# Altium project SAMC21N_Xplained_Pro.PrjPCB (part 3 of 3)

## Sheet SAMC21N_Xplained_Pro_Peripherals.SchDoc: Peripherals
size A3; Organization: Microchip India; DocumentNumber: A09-2682; Revision: 4; SheetNumber: 8; SheetTotal: 9; CheckedBy: M.S.K; DrawnBy: Microchip India; PageSetup: Record=PageOptions|CenterHorizontal=True|CenterVertical=True|PrintScale=1.01|XCorrection=1.00|YCorrection=1.00|PrintKind=1|BorderSize=5000000|LeftOffset=0|BottomOffset=0|Orientation=2|PaperLength=1000|PaperWidth=1000|Scale=100|PaperSource=7|PrintQuality=-4|MediaType=1|DitherType=10|PaperKind=A3 (297 x 420 mm)|PrintScaleMode=1; ProjectTitle: ATSAMC21N-XPRO; PCBNumber: A08-2581; PCBRevision: 2
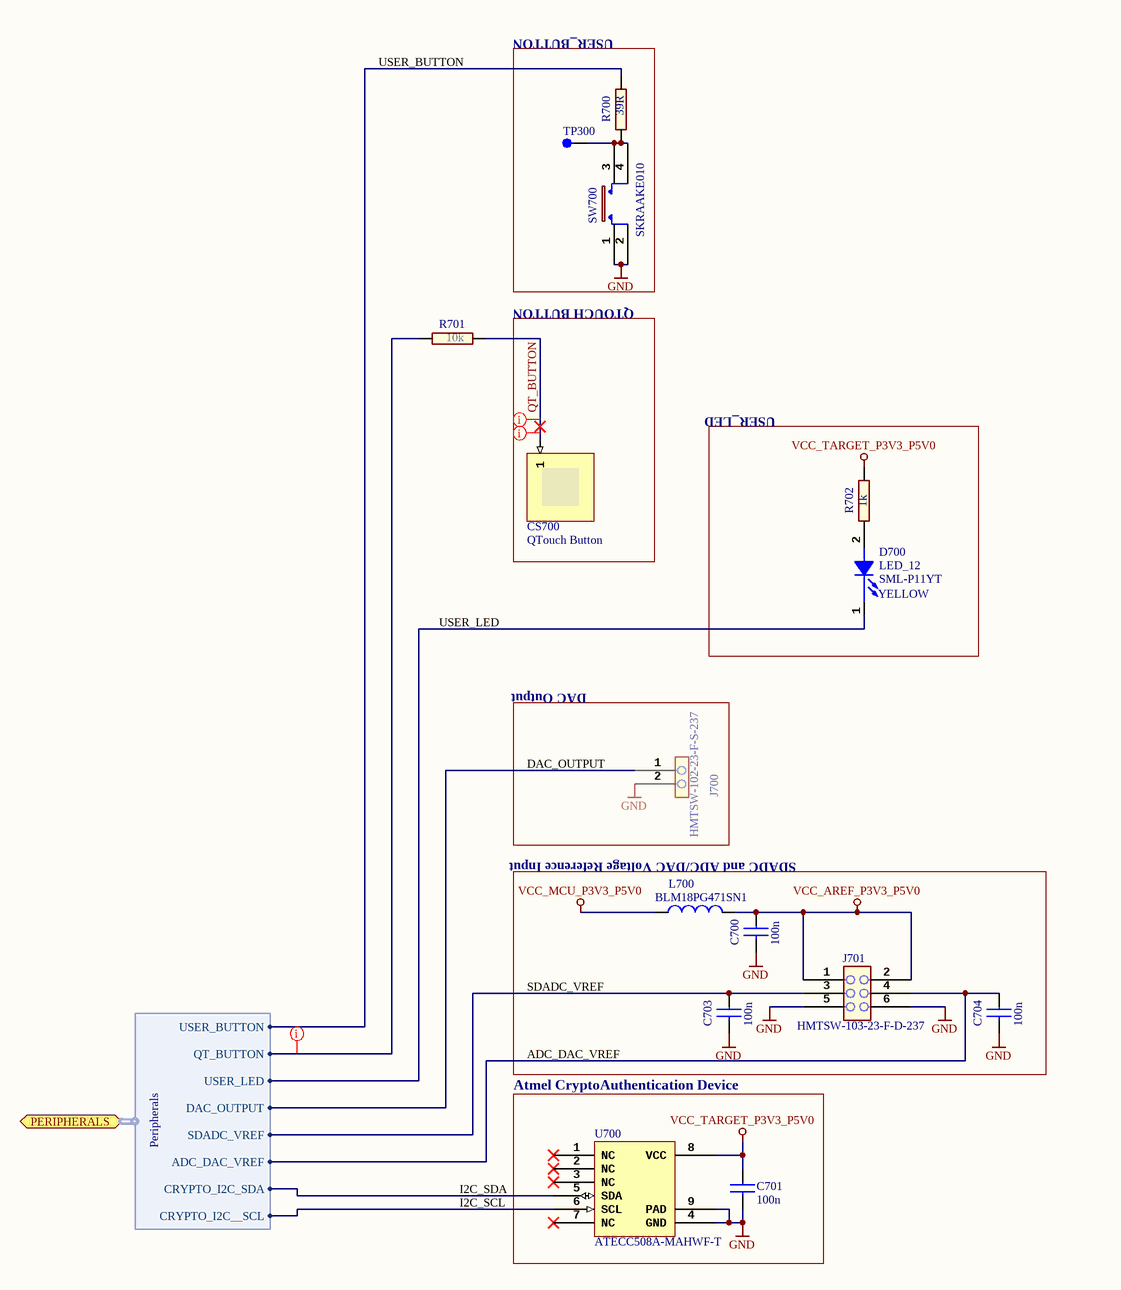
[diagram p8: SAMC21N_Xplained_Pro_Peripherals.SchDoc]

### Parts
C700  value 100n  [AP1-00001]  (hidden comment: CAP-NONPOL)
C701  value 100n  [AP1-00001]  (hidden comment: CAP-NONPOL)
C703  value 100n  [AP1-00001]  (hidden comment: CAP-NONPOL)
C704  value 100n  [AP1-00001]  (hidden comment: CAP-NONPOL)
CS700  QTouch Button  (graphical)
D700  LED_12  value SML-P11YT  [AP4-00160]
J700  value HMTSW-102-23-F-S-237  [AP8-00733]  (hidden comment: HEADER 1x2)
J701  value HMTSW-103-23-F-D-237  [AP8-00182]  (hidden comment: HEADER 2x3)
L700  BLM18PG471SN1  [AP3-00005]
R700  value 39R  [AP2-00000]  (hidden comment: R2)
R701  value 10k  [AP2-00000]  (hidden comment: R2)
R702  value 1k  [AP2-00000]  (hidden comment: R2)
SW700  value SKRAAKE010  [AP8-00137]  (hidden comment: Can be ordered in low volumes from Mouser)
TP300  TESTPOINT  [AP8-00010]  (value not drawn)  (no BOM)
U700  value ATECC508A-MAHWF-T  [AP6-00409]  (hidden comment: ATECC108_UDFN)

### Blocks framed on the sheet
USER_BUTTON: R700 SW700 TP300
QTOUCH BUTTON: CS700
USER_LED: D700 R702
DAC Output: J700
SDADC and ADC/DAC Voltage Reference Input: C700 C703 C704 J701 L700
Atmel CryptoAuthentication Device: C701 U700

### Ports
PERIPHERALS (harness Peripherals)

### Harnesses
Peripherals: DAC_OUTPUT, ADC_DAC_VREF, SDADC_VREF, QT_BUTTON, USER_LED, USER_BUTTON, CRYPTO_I2C__SCL, CRYPTO_I2C_SDA

### Nets
GND: C700.2 C701.2 C703.2 C704.2 J700.2 J701.5 J701.6 SW700.1 SW700.2 U700.4(GND) U700.9(PAD)
VCC_AREF_P3V3_P5V0: C700.1 J701.1 J701.2 L700.2
VCC_MCU_P3V3_P5V0: L700.1
VCC_TARGET_P3V3_P5V0: C701.1 R702.2 U700.8(VCC)
PA02_DAC_VOUT: J700.1 ; port PERIPHERALS.DAC_OUTPUT
PA03_ADC_DAC_VREF: C704.1 J701.4 ; port PERIPHERALS.ADC_DAC_VREF
PA04_SDADC_VREF: C703.1 J701.3 ; port PERIPHERALS.SDADC_VREF
PA05_QTB_Y3: R701.1 ; port PERIPHERALS.QT_BUTTON
PA16_S1_I2C_SDA: U700.5(SDA) ; port PERIPHERALS.CRYPTO_I2C_SDA
PA17_S1_I2C_SCL: U700.6(SCL) ; port PERIPHERALS.CRYPTO_I2C__SCL
PB19_GPIO_IRQ3: R700.2 ; port PERIPHERALS.USER_BUTTON
PC05_TCC2_WO1: D700.1(CATHODE) ; port PERIPHERALS.USER_LED
QT_BUTTON: CS700.1 R701.2
NetD700_2: D700.2(ANODE) R702.1
NetR700_1: R700.1 SW700.3 SW700.4 TP300.1

Not connected (* = marked no-connect by the designer): U700 1(NC)* 2(NC)* 3(NC)* 7(NC)*

### Layout directives
rule Assembly Testpoint Usage [Testpoint - Not Allowed    Multiple - Not Allowed]: PA05_QTB_Y3, QT_BUTTON
net class TOUCH; rule Clearance Constraint [Clearance = 0.6mm]: QT_BUTTON

### Notes on the sheet
- USER_BUTTON
- USER_LED
- (near D700) YELLOW
- DAC_OUTPUT
- SDADC_VREF
- ADC_DAC_VREF
- I2C_SDA
- I2C_SCL
- Drawn By:
- Project Title
- Engineer:
- Designed with
- Sheet Title
- Size
- A3
- PCB Number:
- PCB Assembly Number:
- PCBA Revision:
- PCB    Revision:
- Date:
- Altium.com <http://go.altium.com/MicrochipLandingPage_Evaluation.html>
- File:
- Page:

### Library data of the parts
C700 C701 C703 C704 = A01-0246: Ceramic capacitor, SMD 0402, X7R, 16V, +/-10%; PartGroup: Capacitors,Ceramic,SMD 0402; Manufacturer: Kemet; MPN: C0402C104K4RACTU; TemperatureRange: -55 - +125 deg C; ComponentStatus: 'Active (verified)'; Status: Active; Verified by: Lars Helge Mo; Verified date: 2005-12-15; AN: A01-0246; Tolerance: 16V, +/-10%; FootprintStatus: 'Active (Verified)'
  C700 C703 C704: Height: 0,5
  C701: Height: 0.5
CS700 = QTouchButton: ConfiguratorName: ATMEL_TOUCH; ConfigurationParameters: {}__sensorid[1]{}width[8]{}height[8]{}
D700 = A10-0182: LED, SMD 0402, Yellow, Wave length=586nm, 7.6mcd @ (1mA, 1.9Vf); PartGroup: Opto,LEDs,SMD; Manufacturer: ROHM; MPN: SML-P11YT-T86; TemperatureRange: -40 to +85; ComponentStatus: 'Active (verified)'; Verified date: 2006-02-17; Verified by: Sveinung Helgeland; Status: Active; AN: A10-0182; Height: 0.200000002980232; FootprintStatus: 'Active (Verified)'
J700 = A08-1754: 1x2 pin header, 2.54mm pitch, Pin-in-Paste THM; PartGroup: Mechanical devices,Connectors,Pin headers; Manufacturer: SAMTEC; TemperatureRange: - 55 deg C to + 125 deg C; ComponentStatus: 'Active (verified)'; Verified date: 2006-01-30; Verified by: Lars Helge; Status: Active; AN: A08-1754; Height: 6,09999990463257; MPN: HMTSW-102-23-F-S-237; FootprintStatus: 'Active (Verified)'
J701 = A08-1654: 2x3 pin header, 2.54mm pitch, Pin-in-Paste THM; PartGroup: Mechanical devices,Connectors,Pin headers; Manufacturer: SAMTEC; TemperatureRange: - 55 ï¿½C to + 125 ï¿½C; ComponentStatus: 'Active (verified)'; Status: Active; Verified by: Lars Helge Mo; Verified date: 2005-12-15; AN: A08-1654; Height: 6,09999990463257; MPN: HMTSW-103-23-F-D-237; FootprintStatus: 'Active (Verified)'
L700 = A03-0035: SMD RF inductor 0603. Z=470Ohm (@100MHz), Max R(dc)=0.65Ohm, Max current=1A; PartGroup: Inductors,EMI; Manufacturer: Murata; Tolerance: ±25%; TemperatureRange: -55°C to +125°C; ComponentStatus: 'Active (verified)'; Verified date: 2006-01-30; Verified by: Lars Helge Mo; Status: Active; AN: A03-0035; Value: BLM18PG471SN1; Height: 0,800000011920929; MPN: BLM18PG471SN1; FootprintStatus: 'Active (Verified)'
R700 = A02-0178: Thick film resistor, SMD 0402, 1/16W, 1%; PartGroup: Resistors,SMD,0402 1%; TemperatureRange: -55 - +125 deg C; ComponentStatus: 'Active (verified)'; Status: Active; Verified by: Lars Helge Mo; Verified date: 2005-12-19; AN: A02-0178; Tolerance: 1 %; Height: 0,349999994039536; FootprintStatus: 'Active (Verified)'
R701 = A02-0236: Thick film resistor, SMD 0402, 1/16W, 1%; PartGroup: Resistors,SMD,0402 1%; Manufacturer: vishay; MPN: CRCW040210K0FKED; TemperatureRange: -55 - +125 deg C; ComponentStatus: 'Active (verified)'; Status: Active; Verified by: Lars Helge Mo; Verified date: 2005-12-19; AN: A02-0236; Tolerance: 1 %; Height: 0,349999994039536; FootprintStatus: 'Active (Verified)'
R702 = A02-0212: Thick film resistor, SMD 0402, 1/16W, 1%; PartGroup: Resistors,SMD,0402 1%; Manufacturer: ASJ; MPN: CR10-1001-FK; TemperatureRange: -55 - +125 deg C; ComponentStatus: 'Active (verified)'; Status: Active; Verified by: Lars Helge Mo; Verified date: 2005-12-19; AN: A02-0212; Tolerance: 1 %; Height: 0.349999994039536; FootprintStatus: 'Active (Verified)'
SW700 = A08-0790: 6.2x6.2 mm SMD tact switch, same as A08-0091 but less force is needed; PartGroup: Mechanical devices,Switches,SMD; Manufacturer: ALPS; TemperatureRange: -30 - +90 deg C; ComponentStatus: 'Active (verified)'; Status: Active; Verified by: Ketil Skjerve; Verified date: 2006-03-15; AN: A08-0790; Height: 5,09999990463257; MPN: SKRAAKE010; FootprintStatus: 'Active (Verified)'
TP300 = A08-0004: Single SMD testpad; PartGroup: Mechanical devices,Connectors,Test points; ComponentStatus: 'Active (verified)'; Status: Active; Verified by: Sveinung Helgeland; Verified date: 2006-02-17; AN: A08-0004; Value: TESTPAD; Height: 0; FootprintStatus: 'Active (Verified)'
U700 = A06-1294: Secure authentication and product validation device, EEPROM, I2C, 2.0 - 5.5V, UDFN8; PartGroup: Integrated Circuits,Special function,Encryption; Manufacturer: ATMEL; ComponentStatus: 'Active (verified)'; Status: New; AN: A06-1294; Height: 0.600000023841858; MPN: ATECC508A-MAHWF-T; FootprintStatus: 'Active (Verified)'

## Nets that join several sheets
GND: SAMC21N_Xplained_Pro_Target_MCU (26 pins), SAMC21N_Xplained_Pro_EDBG (36 pins), SAMC21N_Xplained_Pro_Connectors (9 pins), SAMC21N_Xplained_Pro_dual_input_power_supply (22 pins), SAMC21N_Xplained_Pro_CAN_LIN (23 pins), SAMC21N_Xplained_Pro_Arduino_Connectors (J800.6 J801.7 J802.6 J802.7), SAMC21N_Xplained_Pro_Level_Converters (56 pins), SAMC21N_Xplained_Pro_Peripherals (11 pins)
VCC_EDBG_P3V3: SAMC21N_Xplained_Pro_EDBG (23 pins), SAMC21N_Xplained_Pro_dual_input_power_supply (J105.1), SAMC21N_Xplained_Pro_Level_Converters (31 pins)
VCC_EDBG_USB_P5V0: SAMC21N_Xplained_Pro_EDBG (C408.1 L401.2 U400.A10), SAMC21N_Xplained_Pro_dual_input_power_supply (Q100.1 R103.2)
VCC_EXT_P5V0: SAMC21N_Xplained_Pro_dual_input_power_supply (5 pins), SAMC21N_Xplained_Pro_Arduino_Connectors (J802.8)
VCC_MCU_P3V3_P5V0: SAMC21N_Xplained_Pro_Target_MCU (13 pins), SAMC21N_Xplained_Pro_dual_input_power_supply (C108.1 J101.1), SAMC21N_Xplained_Pro_Peripherals (L700.1)
VCC_P3V3: SAMC21N_Xplained_Pro_dual_input_power_supply (J102.3 J104.1), SAMC21N_Xplained_Pro_Arduino_Connectors (J802.4)
VCC_P5V0: SAMC21N_Xplained_Pro_dual_input_power_supply (8 pins), SAMC21N_Xplained_Pro_CAN_LIN (C502.1 C509.1 U500.3 U502.3), SAMC21N_Xplained_Pro_Arduino_Connectors (J802.5)
VCC_TARGET_P3V3_P5V0: SAMC21N_Xplained_Pro_Target_MCU (6 pins), SAMC21N_Xplained_Pro_Connectors (J200.20 J201.20 J202.20 J203.1), SAMC21N_Xplained_Pro_dual_input_power_supply (J106.1), SAMC21N_Xplained_Pro_CAN_LIN (6 pins), SAMC21N_Xplained_Pro_Arduino_Connectors (J800.2 J802.2), SAMC21N_Xplained_Pro_Level_Converters (27 pins), SAMC21N_Xplained_Pro_Peripherals (C701.1 R702.2 U700.8)
EDBG_ADC0: SAMC21N_Xplained_Pro_EDBG (U400.K10), SAMC21N_Xplained_Pro_dual_input_power_supply (R111.1 R112.2)
EDBG_ADC1: SAMC21N_Xplained_Pro_EDBG (U400.H6), SAMC21N_Xplained_Pro_dual_input_power_supply (R109.1 R110.2)
EDBG_CDC_UART_OE: SAMC21N_Xplained_Pro_EDBG (U400.D4), SAMC21N_Xplained_Pro_Level_Converters (R606.1 U601.5)
EDBG_CDC_UART_RX: SAMC21N_Xplained_Pro_EDBG (U400.E9), SAMC21N_Xplained_Pro_Level_Converters (U601.3)
EDBG_CDC_UART_TX: SAMC21N_Xplained_Pro_EDBG (U400.F9), SAMC21N_Xplained_Pro_Level_Converters (U602.3)
EDBG_DGI_GPIO0: SAMC21N_Xplained_Pro_EDBG (U400.F8), SAMC21N_Xplained_Pro_Level_Converters (U607.3)
EDBG_DGI_GPIO0_EN: SAMC21N_Xplained_Pro_EDBG (U400.G2), SAMC21N_Xplained_Pro_Level_Converters (R615.1 U607.5)
EDBG_DGI_GPIO1: SAMC21N_Xplained_Pro_EDBG (U400.D8), SAMC21N_Xplained_Pro_Level_Converters (U609.3)
EDBG_DGI_GPIO1_EN: SAMC21N_Xplained_Pro_EDBG (U400.G3), SAMC21N_Xplained_Pro_Level_Converters (R617.1 U609.5)
EDBG_DGI_GPIO2: SAMC21N_Xplained_Pro_EDBG (U400.C10), SAMC21N_Xplained_Pro_Level_Converters (U611.3)
EDBG_DGI_GPIO2_EN: SAMC21N_Xplained_Pro_EDBG (U400.J1), SAMC21N_Xplained_Pro_Level_Converters (R622.1 U611.5)
EDBG_DGI_GPIO3: SAMC21N_Xplained_Pro_EDBG (U400.C9), SAMC21N_Xplained_Pro_Level_Converters (U612.3)
EDBG_DGI_GPIO3_EN: SAMC21N_Xplained_Pro_EDBG (U400.H1), SAMC21N_Xplained_Pro_Level_Converters (R623.1 U612.5)
EDBG_DGI_I2C_OE: SAMC21N_Xplained_Pro_EDBG (U400.A2), SAMC21N_Xplained_Pro_Level_Converters (R604.2 U600.5)
EDBG_DGI_I2C_SCL: SAMC21N_Xplained_Pro_EDBG (U400.F7), SAMC21N_Xplained_Pro_Level_Converters (R602.1 U600.3)
EDBG_DGI_I2C_SDA: SAMC21N_Xplained_Pro_EDBG (U400.G7), SAMC21N_Xplained_Pro_Level_Converters (R601.1 U600.2)
EDBG_DGI_SPI_MISO: SAMC21N_Xplained_Pro_EDBG (U400.K2), SAMC21N_Xplained_Pro_Level_Converters (U608.3)
EDBG_DGI_SPI_MOSI: SAMC21N_Xplained_Pro_EDBG (U400.K3), SAMC21N_Xplained_Pro_Level_Converters (U610.3)
EDBG_DGI_SPI_OE: SAMC21N_Xplained_Pro_EDBG (U400.H4), SAMC21N_Xplained_Pro_Level_Converters (R616.1 U608.5)
EDBG_DGI_SPI_SCK: SAMC21N_Xplained_Pro_EDBG (U400.J4), SAMC21N_Xplained_Pro_Level_Converters (U606.3)
EDBG_DGI_SPI_SS: SAMC21N_Xplained_Pro_EDBG (U400.G5), SAMC21N_Xplained_Pro_Level_Converters (U604.3)
EDBG_SWCLK: SAMC21N_Xplained_Pro_EDBG (U400.D6), SAMC21N_Xplained_Pro_Level_Converters (U605.3)
EDBG_SWD_SWCLK_OE: SAMC21N_Xplained_Pro_EDBG (U400.B7), SAMC21N_Xplained_Pro_Level_Converters (R613.1 U605.5)
EDBG_SWD_SWDIO_OE: SAMC21N_Xplained_Pro_EDBG (U400.K1), SAMC21N_Xplained_Pro_Level_Converters (R608.1 U603.5)
EDBG_SWDIO: SAMC21N_Xplained_Pro_EDBG (U400.C5), SAMC21N_Xplained_Pro_Level_Converters (U603.3)
ID1: SAMC21N_Xplained_Pro_EDBG (R409.1 U400.A1), SAMC21N_Xplained_Pro_Connectors (J200.1)
ID2: SAMC21N_Xplained_Pro_EDBG (R402.1 U400.B2), SAMC21N_Xplained_Pro_Connectors (J201.1)
ID3: SAMC21N_Xplained_Pro_EDBG (R401.1 U400.B3), SAMC21N_Xplained_Pro_Connectors (J202.1)
PA02_DAC_VOUT: SAMC21N_Xplained_Pro_Target_MCU (U300.7), SAMC21N_Xplained_Pro_Peripherals (J700.1)
PA03_ADC_DAC_VREF: SAMC21N_Xplained_Pro_Target_MCU (U300.8), SAMC21N_Xplained_Pro_Arduino_Connectors (J801.8), SAMC21N_Xplained_Pro_Peripherals (C704.1 J701.4)
PA04_SDADC_VREF: SAMC21N_Xplained_Pro_Target_MCU (U300.17), SAMC21N_Xplained_Pro_Peripherals (C703.1 J701.3)
PA05_QTB_Y3: SAMC21N_Xplained_Pro_Target_MCU (U300.18), SAMC21N_Xplained_Pro_Peripherals (R701.1)
PA06_S0_LIN_TX: SAMC21N_Xplained_Pro_Target_MCU (U300.19), SAMC21N_Xplained_Pro_CAN_LIN (U501.4)
PA07_S0_LIN_RX: SAMC21N_Xplained_Pro_Target_MCU (U300.20), SAMC21N_Xplained_Pro_CAN_LIN (R504.1 U501.1)
PA08_AIN10_X0: SAMC21N_Xplained_Pro_Target_MCU (U300.26), SAMC21N_Xplained_Pro_Connectors (J201.3)
PA09_AIN11_X1: SAMC21N_Xplained_Pro_Target_MCU (U300.27), SAMC21N_Xplained_Pro_Connectors (J201.4)
PA10_S2_RTS_TE_Y18: SAMC21N_Xplained_Pro_Target_MCU (U300.28), SAMC21N_Xplained_Pro_Connectors (J200.5)
PA11_S2_CTS_Y19: SAMC21N_Xplained_Pro_Target_MCU (U300.29), SAMC21N_Xplained_Pro_Connectors (J200.6)
PA12_S2_UART_TX: SAMC21N_Xplained_Pro_Target_MCU (U300.46), SAMC21N_Xplained_Pro_Connectors (J200.14)
PA13_S2_UART_RX: SAMC21N_Xplained_Pro_Target_MCU (U300.47), SAMC21N_Xplained_Pro_Connectors (J200.13)
PA14_PWM_TC3_WO0: SAMC21N_Xplained_Pro_Target_MCU (R313.2), SAMC21N_Xplained_Pro_Arduino_Connectors (J804.4)
PA15_PWM_TC3_WO1: SAMC21N_Xplained_Pro_Target_MCU (R314.2), SAMC21N_Xplained_Pro_Arduino_Connectors (J804.6)
PA16_S1_I2C_SDA: SAMC21N_Xplained_Pro_Target_MCU (R305.1 U300.52), SAMC21N_Xplained_Pro_Connectors (J201.11 J202.11), SAMC21N_Xplained_Pro_Arduino_Connectors (J801.9), SAMC21N_Xplained_Pro_Level_Converters (U600.7), SAMC21N_Xplained_Pro_Peripherals (U700.5)
PA17_S1_I2C_SCL: SAMC21N_Xplained_Pro_Target_MCU (R306.1 U300.53), SAMC21N_Xplained_Pro_Connectors (J201.12 J202.12), SAMC21N_Xplained_Pro_Arduino_Connectors (J801.10), SAMC21N_Xplained_Pro_Level_Converters (U600.6), SAMC21N_Xplained_Pro_Peripherals (U700.6)
PA18_S1_SPI_MOSI_Y22: SAMC21N_Xplained_Pro_Target_MCU (U300.54), SAMC21N_Xplained_Pro_Connectors (J200.16)
PA19_S1_SPI_SCK_Y23: SAMC21N_Xplained_Pro_Target_MCU (U300.55), SAMC21N_Xplained_Pro_Connectors (J200.18)
PA20_S3_RTS_TE_X8: SAMC21N_Xplained_Pro_Target_MCU (U300.70), SAMC21N_Xplained_Pro_Connectors (J201.5)
PA21_S3_CTS_X9: SAMC21N_Xplained_Pro_Target_MCU (U300.71), SAMC21N_Xplained_Pro_Connectors (J201.6)
PA22_IRQ6_X10_Y26: SAMC21N_Xplained_Pro_Target_MCU (U300.72), SAMC21N_Xplained_Pro_Connectors (J200.9), SAMC21N_Xplained_Pro_Level_Converters (R619.2)
PA23_GPIO_X11_Y27: SAMC21N_Xplained_Pro_Target_MCU (U300.73), SAMC21N_Xplained_Pro_Connectors (J200.10)
PA24_CAN0_TX: SAMC21N_Xplained_Pro_Target_MCU (U300.74), SAMC21N_Xplained_Pro_CAN_LIN (U500.1)
PA25_CAN0_RX: SAMC21N_Xplained_Pro_Target_MCU (U300.75), SAMC21N_Xplained_Pro_CAN_LIN (C501.1 U500.4)
PA27_GPIO_SS: SAMC21N_Xplained_Pro_Target_MCU (U300.87), SAMC21N_Xplained_Pro_Connectors (J202.10)
PA28_GPIO_IRQ8: SAMC21N_Xplained_Pro_Target_MCU (U300.89), SAMC21N_Xplained_Pro_Connectors (J202.9), SAMC21N_Xplained_Pro_Level_Converters (R621.2)
PA30_SWCLK: SAMC21N_Xplained_Pro_Target_MCU (R301.1 U300.93), SAMC21N_Xplained_Pro_Connectors (J203.4), SAMC21N_Xplained_Pro_Level_Converters (R612.2)
PA31_SWDIO: SAMC21N_Xplained_Pro_Target_MCU (U300.94), SAMC21N_Xplained_Pro_Connectors (J203.2), SAMC21N_Xplained_Pro_Level_Converters (R611.2)
PB00_S5_SPI_MOSI: SAMC21N_Xplained_Pro_Target_MCU (U300.97), SAMC21N_Xplained_Pro_Connectors (J201.16)
PB01_S5_SPI_SCK: SAMC21N_Xplained_Pro_Target_MCU (U300.98), SAMC21N_Xplained_Pro_Connectors (J201.18)
PB02_S5_SPI_MISO: SAMC21N_Xplained_Pro_Target_MCU (U300.99), SAMC21N_Xplained_Pro_Connectors (J201.17)
PB03_S5_SPI_SS: SAMC21N_Xplained_Pro_Target_MCU (U300.100), SAMC21N_Xplained_Pro_Connectors (J201.15)
PB04_GPIO: SAMC21N_Xplained_Pro_Target_MCU (U300.9), SAMC21N_Xplained_Pro_Arduino_Connectors (J804.8)
PB06_AIN8_INN2: SAMC21N_Xplained_Pro_Target_MCU (U300.13), SAMC21N_Xplained_Pro_Connectors (J202.4)
PB07_AIN9_INP2: SAMC21N_Xplained_Pro_Target_MCU (U300.14), SAMC21N_Xplained_Pro_Connectors (J202.3)
PB08_INN1_Y14: SAMC21N_Xplained_Pro_Target_MCU (U300.15), SAMC21N_Xplained_Pro_Connectors (J200.4), SAMC21N_Xplained_Pro_Arduino_Connectors (J803.2)
PB09_INP1_Y15: SAMC21N_Xplained_Pro_Target_MCU (U300.16), SAMC21N_Xplained_Pro_Connectors (J200.3), SAMC21N_Xplained_Pro_Arduino_Connectors (J803.1)
PB10_S4_CDC_TX: SAMC21N_Xplained_Pro_Target_MCU (U300.30), SAMC21N_Xplained_Pro_Level_Converters (U602.4)
PB11_S4_CDC_RX: SAMC21N_Xplained_Pro_Target_MCU (U300.31), SAMC21N_Xplained_Pro_Level_Converters (R607.1)
PB12_TC4_WO0_X12_Y28: SAMC21N_Xplained_Pro_Target_MCU (U300.32), SAMC21N_Xplained_Pro_Connectors (J200.7), SAMC21N_Xplained_Pro_Level_Converters (R618.2)
PB13_TC4_WO1_X13_Y29: SAMC21N_Xplained_Pro_Target_MCU (U300.33), SAMC21N_Xplained_Pro_Connectors (J200.8)
PB14_CAN1_TX: SAMC21N_Xplained_Pro_Target_MCU (U300.34), SAMC21N_Xplained_Pro_CAN_LIN (U502.1)
PB15_CAN1_RX: SAMC21N_Xplained_Pro_Target_MCU (U300.35), SAMC21N_Xplained_Pro_CAN_LIN (C508.1 U502.4)
PB16_S5_I2C_SDA: SAMC21N_Xplained_Pro_Target_MCU (R315.1 U300.64), SAMC21N_Xplained_Pro_Connectors (J200.11)
PB17_S5_I2C_SCL: SAMC21N_Xplained_Pro_Target_MCU (R316.1 U300.65), SAMC21N_Xplained_Pro_Connectors (J200.12)
PB19_GPIO_IRQ3: SAMC21N_Xplained_Pro_Target_MCU (U300.67), SAMC21N_Xplained_Pro_Peripherals (R700.2)
PB20_S3_UART_TX: SAMC21N_Xplained_Pro_Target_MCU (U300.68), SAMC21N_Xplained_Pro_Connectors (J201.14)
PB21_S3_UART_RX: SAMC21N_Xplained_Pro_Target_MCU (U300.69), SAMC21N_Xplained_Pro_Connectors (J201.13)
PB22_TCC1_WO2: SAMC21N_Xplained_Pro_Target_MCU (U300.78), SAMC21N_Xplained_Pro_Connectors (J202.7)
PB23_TCC1_WO3: SAMC21N_Xplained_Pro_Target_MCU (U300.79), SAMC21N_Xplained_Pro_Connectors (J202.8)
PB24_S0_UART_TX: SAMC21N_Xplained_Pro_Target_MCU (U300.80), SAMC21N_Xplained_Pro_Arduino_Connectors (J804.2)
PB25_S0_UART_RX: SAMC21N_Xplained_Pro_Target_MCU (U300.81), SAMC21N_Xplained_Pro_Arduino_Connectors (J804.1)
PB30_PWM_TC0_WO0: SAMC21N_Xplained_Pro_Target_MCU (U300.95), SAMC21N_Xplained_Pro_Connectors (J201.7), SAMC21N_Xplained_Pro_Arduino_Connectors (J804.7)
PB31_PWM_TC0_WO1: SAMC21N_Xplained_Pro_Target_MCU (U300.96), SAMC21N_Xplained_Pro_Connectors (J201.8), SAMC21N_Xplained_Pro_Arduino_Connectors (J801.2)
PC00_ADC0_AIN8: SAMC21N_Xplained_Pro_Target_MCU (U300.3), SAMC21N_Xplained_Pro_Arduino_Connectors (J803.3)
PC01_ADC0_AIN9: SAMC21N_Xplained_Pro_Target_MCU (U300.4), SAMC21N_Xplained_Pro_Arduino_Connectors (J803.4)
PC02_ADC0_AIN10: SAMC21N_Xplained_Pro_Target_MCU (U300.5), SAMC21N_Xplained_Pro_Arduino_Connectors (J803.5)
PC03_ADC0_AIN11: SAMC21N_Xplained_Pro_Target_MCU (U300.6), SAMC21N_Xplained_Pro_Arduino_Connectors (J803.6)
PC05_TCC2_WO1: SAMC21N_Xplained_Pro_Target_MCU (U300.21), SAMC21N_Xplained_Pro_Peripherals (D700.1)
PC09_SPI_S7_SS: SAMC21N_Xplained_Pro_Target_MCU (U300.39), SAMC21N_Xplained_Pro_Level_Converters (U604.4)
PC11_S7_SPI_SCK: SAMC21N_Xplained_Pro_Target_MCU (U300.41), SAMC21N_Xplained_Pro_Connectors (J202.18), SAMC21N_Xplained_Pro_Arduino_Connectors (J800.3 J801.6), SAMC21N_Xplained_Pro_Level_Converters (U606.4)
PC12_S7_SPI_MISO: SAMC21N_Xplained_Pro_Target_MCU (U300.42), SAMC21N_Xplained_Pro_Connectors (J202.17), SAMC21N_Xplained_Pro_Arduino_Connectors (J800.1 J801.5), SAMC21N_Xplained_Pro_Level_Converters (R614.2)
PC13_S7_SPI_SS: SAMC21N_Xplained_Pro_Target_MCU (U300.43), SAMC21N_Xplained_Pro_Connectors (J202.15)
PC14_S7_SPI_MOSI: SAMC21N_Xplained_Pro_Target_MCU (U300.44), SAMC21N_Xplained_Pro_Connectors (J202.16), SAMC21N_Xplained_Pro_Arduino_Connectors (J800.4 J801.4), SAMC21N_Xplained_Pro_Level_Converters (U610.4)
PC15_GPIO_LIN_EN: SAMC21N_Xplained_Pro_Target_MCU (U300.45), SAMC21N_Xplained_Pro_CAN_LIN (U501.2)
PC16_S6_UART_TX: SAMC21N_Xplained_Pro_Target_MCU (U300.56), SAMC21N_Xplained_Pro_Connectors (J202.14)
PC17_S6_UART_RX: SAMC21N_Xplained_Pro_Target_MCU (U300.57), SAMC21N_Xplained_Pro_Connectors (J202.13)
PC18_S6_RTS_TE: SAMC21N_Xplained_Pro_Target_MCU (U300.58), SAMC21N_Xplained_Pro_Connectors (J202.5)
PC19_S6_CTS: SAMC21N_Xplained_Pro_Target_MCU (U300.59), SAMC21N_Xplained_Pro_Connectors (J202.6)
PC20_GPIO: SAMC21N_Xplained_Pro_Target_MCU (U300.60), SAMC21N_Xplained_Pro_Arduino_Connectors (J804.3)
PC21_GPIO: SAMC21N_Xplained_Pro_Target_MCU (U300.61), SAMC21N_Xplained_Pro_Arduino_Connectors (J804.5)
PC24_GPIO_IRQ0: SAMC21N_Xplained_Pro_Target_MCU (U300.82), SAMC21N_Xplained_Pro_Connectors (J201.9), SAMC21N_Xplained_Pro_Level_Converters (R620.2)
PC25_GPIO: SAMC21N_Xplained_Pro_Target_MCU (U300.83), SAMC21N_Xplained_Pro_Connectors (J201.10)
PC26_GPIO: SAMC21N_Xplained_Pro_Target_MCU (U300.84), SAMC21N_Xplained_Pro_Arduino_Connectors (J801.1)
PC27_S1_SPI_MISO: SAMC21N_Xplained_Pro_Target_MCU (U300.85), SAMC21N_Xplained_Pro_Connectors (J200.17)
PC28_S1_SPI_SS: SAMC21N_Xplained_Pro_Target_MCU (U300.86), SAMC21N_Xplained_Pro_Connectors (J200.15)
~{TARGET_VCC_ENABLE}: SAMC21N_Xplained_Pro_EDBG (U400.J10), SAMC21N_Xplained_Pro_dual_input_power_supply (Q102.1 R105.2)
TARGET_RESET: SAMC21N_Xplained_Pro_EDBG (U400.B4), SAMC21N_Xplained_Pro_Level_Converters (Q601.3 R624.1)
TARGET_RESET_CON: SAMC21N_Xplained_Pro_Connectors (J203.10), SAMC21N_Xplained_Pro_Arduino_Connectors (R800.1), SAMC21N_Xplained_Pro_Level_Converters (R609.1 R610.2)
TARGET_RESET_SENSE: SAMC21N_Xplained_Pro_Target_MCU (C301.1 R300.1 R304.2 U300.88), SAMC21N_Xplained_Pro_Level_Converters (R609.2)
TARGET_RESET_SENSE_LEVEL: SAMC21N_Xplained_Pro_EDBG (U400.H2), SAMC21N_Xplained_Pro_Level_Converters (Q600.6 R603.1)

## Assembly variants
Default_assembly: not fitted C107 C318 C319 C403 J800 J801 J802 J803 J804 R424 XC301